# Altium project RTL-00-expansion_v1.0.PrjPcb
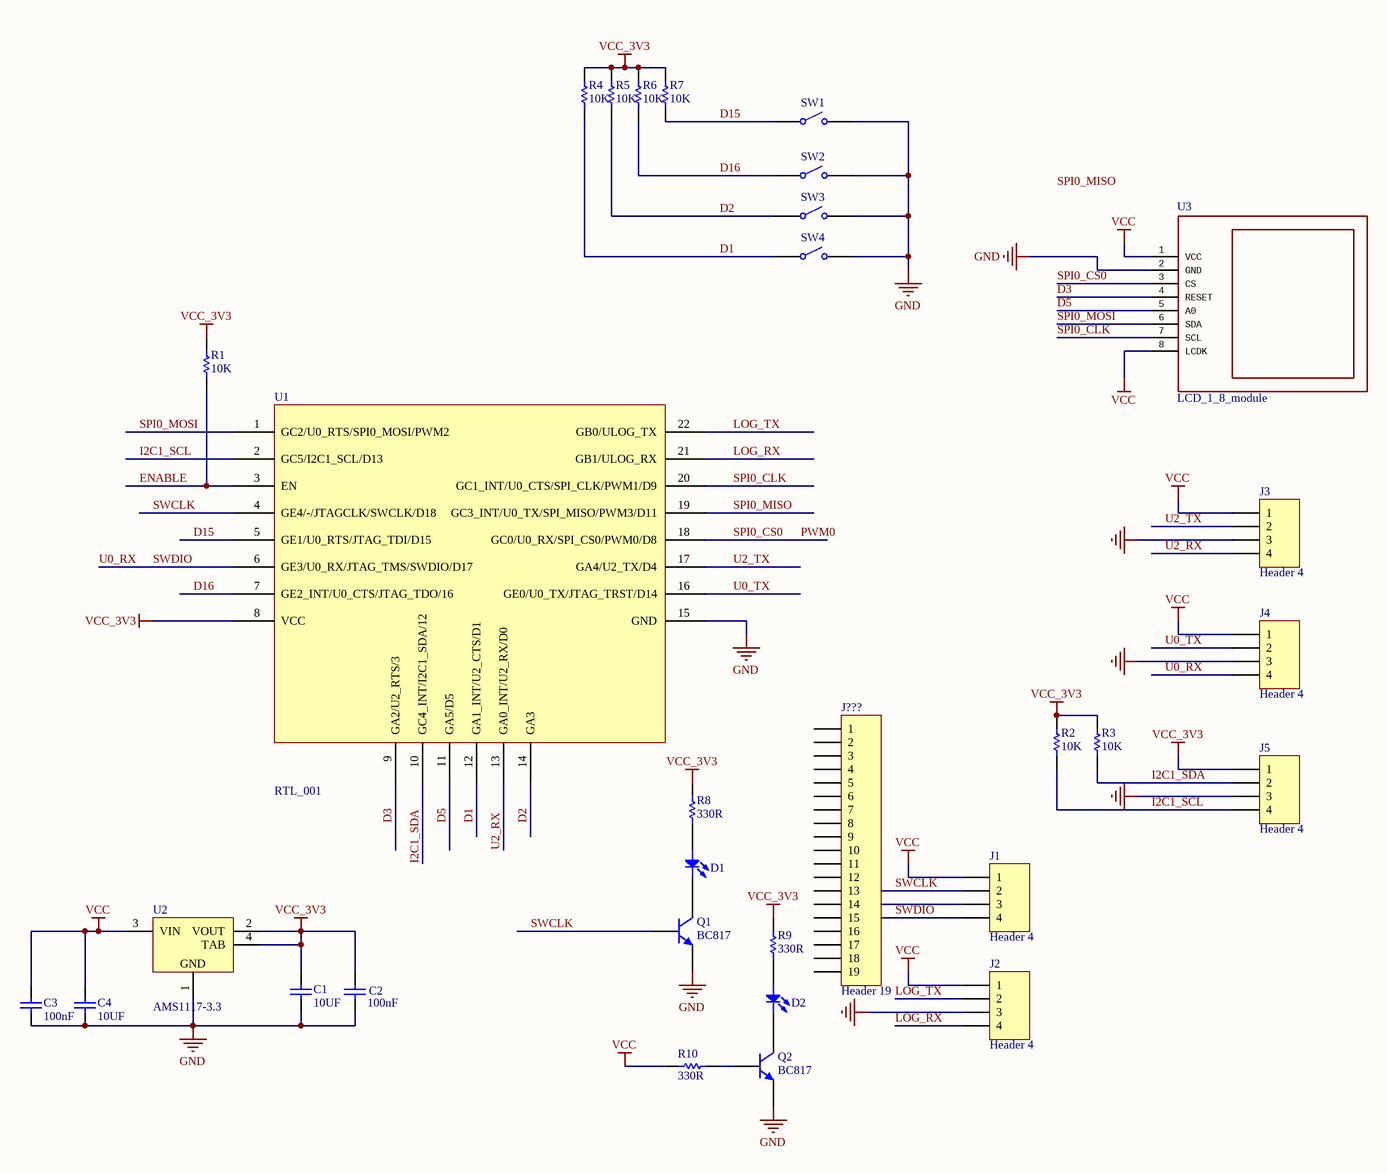
[diagram p0: rtl_001_expansion_v1.0.SchDoc]
1 sheet, 31 parts. Net scope: global (net labels, ports and power ports of the same name join across sheets).
Board file: rtl_001_expansion_v1.0.PcbDoc

## Sheet rtl_001_expansion_v1.0.SchDoc
size A3

### Parts
C1  10UF  [CAP_SMD[ 0805]]
C2  100nF  [CAP_SMD[ 0603]]
C3  100nF  [CAP_SMD[ 0603]]
C4  10UF  [CAP_SMD[ 0805]]
D1  LED_SMD[0805]  [LED_SMD[0805]]  (value not drawn)
D2  LED_SMD[0805]  [LED_SMD[0805]]  (value not drawn)
J1  Header 4  [HEADER 4X1]
J2  Header 4  [HEADER 4X1]
J3  Header 4  [HEADER 4X1]
J4  Header 4  [HEADER 4X1]
J5  Header 4  [HEADER 4X1]
J???  Header 19  [HDR1X19]
Q1  BC817  [SOT-23]
Q2  BC817  [SOT-23]
R1  10K  [res_smd [0603]]
R2  10K  [res_smd [0603]]
R3  10K  [res_smd [0603]]
R4  10K  [res_smd [0603]]
R5  10K  [res_smd [0603]]
R6  10K  [res_smd [0603]]
R7  10K  [res_smd [0603]]
R8  330R  [res_smd [0603]]
R9  330R  [res_smd [0603]]
R10  330R  [res_smd [0603]]
SW1  (no value)  [434111043826]
SW2  (no value)  [434111043826]
SW3  (no value)  [434111043826]
SW4  (no value)  [434111043826]
U1  RTL_001  [RTL-001]
U2  AMS1117-3.3  [SOT-223]
U3  LCD_1_8_module  [LCD_1_8_inch_module]

### Nets
GND: C1.1 C2.1 C3.1 C4.1 J1.3 J2.3 J3.3 J4.3 J5.3 Q1.2(E) Q2.2(E) SW1.2 SW2.2 SW3.2 SW4.2 U1.15(GND) U2.1 U3.2(GND)
VCC: C3.2 C4.2 J1.1 J2.1 J3.1 J4.1 R10.2 U2.3(VIN) U3.1(VCC) U3.8(LCDK)
VCC_3V3: C1.2 C2.2 J5.1 R1.2 R2.2 R3.2 R4.2 R5.2 R6.2 R7.2 R8.2 R9.2 U1.8(VCC) U2.2(VOUT) U2.4(TAB)
D1: R4.1 SW4.1 U1.12(GA1_INT/U2_CTS/D1)
D2: R5.1 SW3.1 U1.14(GA3)
D3: U1.9(GA2/U2_RTS/3) U3.4(RESET)
D5: U1.11(GA5/D5) U3.5(A0)
D15: R7.1 SW1.1 U1.5(GE1/U0_RTS/JTAG_TDI/D15)
D16: R6.1 SW2.1 U1.7(GE2_INT/U0_CTS/JTAG_TDO/16)
ENABLE: R1.1 U1.3(EN)
I2C1_SCL: J5.4 R2.1 U1.2(GC5/I2C1_SCL/D13)
I2C1_SDA: J5.2 R3.1 U1.10(GC4_INT/I2C1_SDA/12)
LOG_RX: J2.4 U1.21(GB1/ULOG_RX)
LOG_TX: J2.2 U1.22(GB0/ULOG_TX)
PWM0: U1.18(GC0/U0_RX/SPI_CS0/PWM0/D8) U3.3(CS)  [also labelled SPI0_CS0]
SPI0_CLK: U1.20(GC1_INT/U0_CTS/SPI_CLK/PWM1/D9) U3.7(SCL)
SPI0_MISO: U1.19(GC3_INT/U0_TX/SPI_MISO/PWM3/D11)
SPI0_MOSI: U1.1(GC2/U0_RTS/SPI0_MOSI/PWM2) U3.6(SDA)
SWCLK: J1.2 Q1.1(B) U1.4(GE4/-/JTAGCLK/SWCLK/D18)
SWDIO: J1.4 J4.4 U1.6(GE3/U0_RX/JTAG_TMS/SWDIO/D17)  [also labelled U0_RX]
U0_TX: J4.2 U1.16(GE0/U0_TX/JTAG_TRST/D14)
U2_RX: J3.4 U1.13(GA0_INT/U2_RX/D0)
U2_TX: J3.2 U1.17(GA4/U2_TX/D4)
NetD1_1: D1.1(A) R8.1
NetD1_2: D1.2(K) Q1.3(C)
NetD2_1: D2.1(A) R9.1
NetD2_2: D2.2(K) Q2.3(C)
NetQ2_1: Q2.1(B) R10.1

Not connected (* = marked no-connect by the designer): J??? 1 2 3 4 5 6 7 8 9 10 11 12 13 14 15 16 17 18 19

### Notes on the sheet
- Labels drawn without touching a wire or pin: SPI0_MISO
- (in symbol AMS1117-3.3) GND

### Library data of the parts
C1 C4 = CAP_smd [0805]: capacitor; brief description: ceramic capacitor; Device Type: CAPACITOR; Package Type: smd; part number: Capacitor; Package: [0805]
C2 C3 = CAP_smd [0603]: capacitor; brief description: ceramic capacitor; Device Type: CAPACITOR; Package Type: smd; part number: Capacitor; Package: [0603]
D1 D2 = LED_SMD[0805]: Typical (?COLOR?) LED; Device Type: MISCELLANEOUS; فروشگاه: کا الکترونیک; قیمت: 900-620; brief description: Typical (?COLOR?) LED; Package Type: smd; Package: [0805]
J1-J5 = Header 4: Header, 4-Pin; Device Type: CONNECTOR; brief description: Header, 4-Pin; Package: Header, 4-Pin(2.54mm); Package Type: through hole
J??? = Header 19: Header, 19-Pin; Device Type: CONNECTOR; Revision: 17-Jul-2002: Re-released for DXP Platform.; brief description: Header, 19-Pin; Package Type: through hole; Package: Header, 19-Pin(2.54)
Q1 Q2 = BC817: SMD;TRANSISTOR;BC817;SOT-23;NPN;(General-purpose); قیمت: 420-1.500  1.000تا-1; فروشگاه: جوان الکترونیک-کا الکترونیک-پایا الکترونیک; پکیج: SOT-23; توضیح: SMD;TRANSISTOR;BC817;SOT-23;NPN;(General-purpose)
R1-R10 = Res_smd [0603]: Resistor; Revision: July-2002: Re-released for DXP Platform.; Device Type: RESISTOR; Package Type: smd; part number: Resistor; Package: [0603]
SW1-SW4 = WE-Tact Switches WS-TASV 434111043826: WS-TASV SMD Tact Switch 6.0X3.5 mm; Manufacturer: W¨¹rth Elektronik eiSos GmbH & Co.KG; ComponentLink1 Description: Manufacturer; ComponentLink2 Description: Datasheet; Creat by: Karrer Zheng; NoPins: 02; Creat Date: 5 March February 2014; partNo: 434111043826; ComponentLink1URL: http://www.we-online.com; ComponentLink2URL: http://katalog.we-online.de/em/datasheet/434111043826.pdf
U2 = AMS1117-3.3: Adjustable/Fixed Low Dropout Linear Regulator; قیمت: 1.570; فروشگاه: جوان الکترونیک; پکیج: SOT-223; توضیح: Adjustable/Fixed Low Dropout Linear Regulator